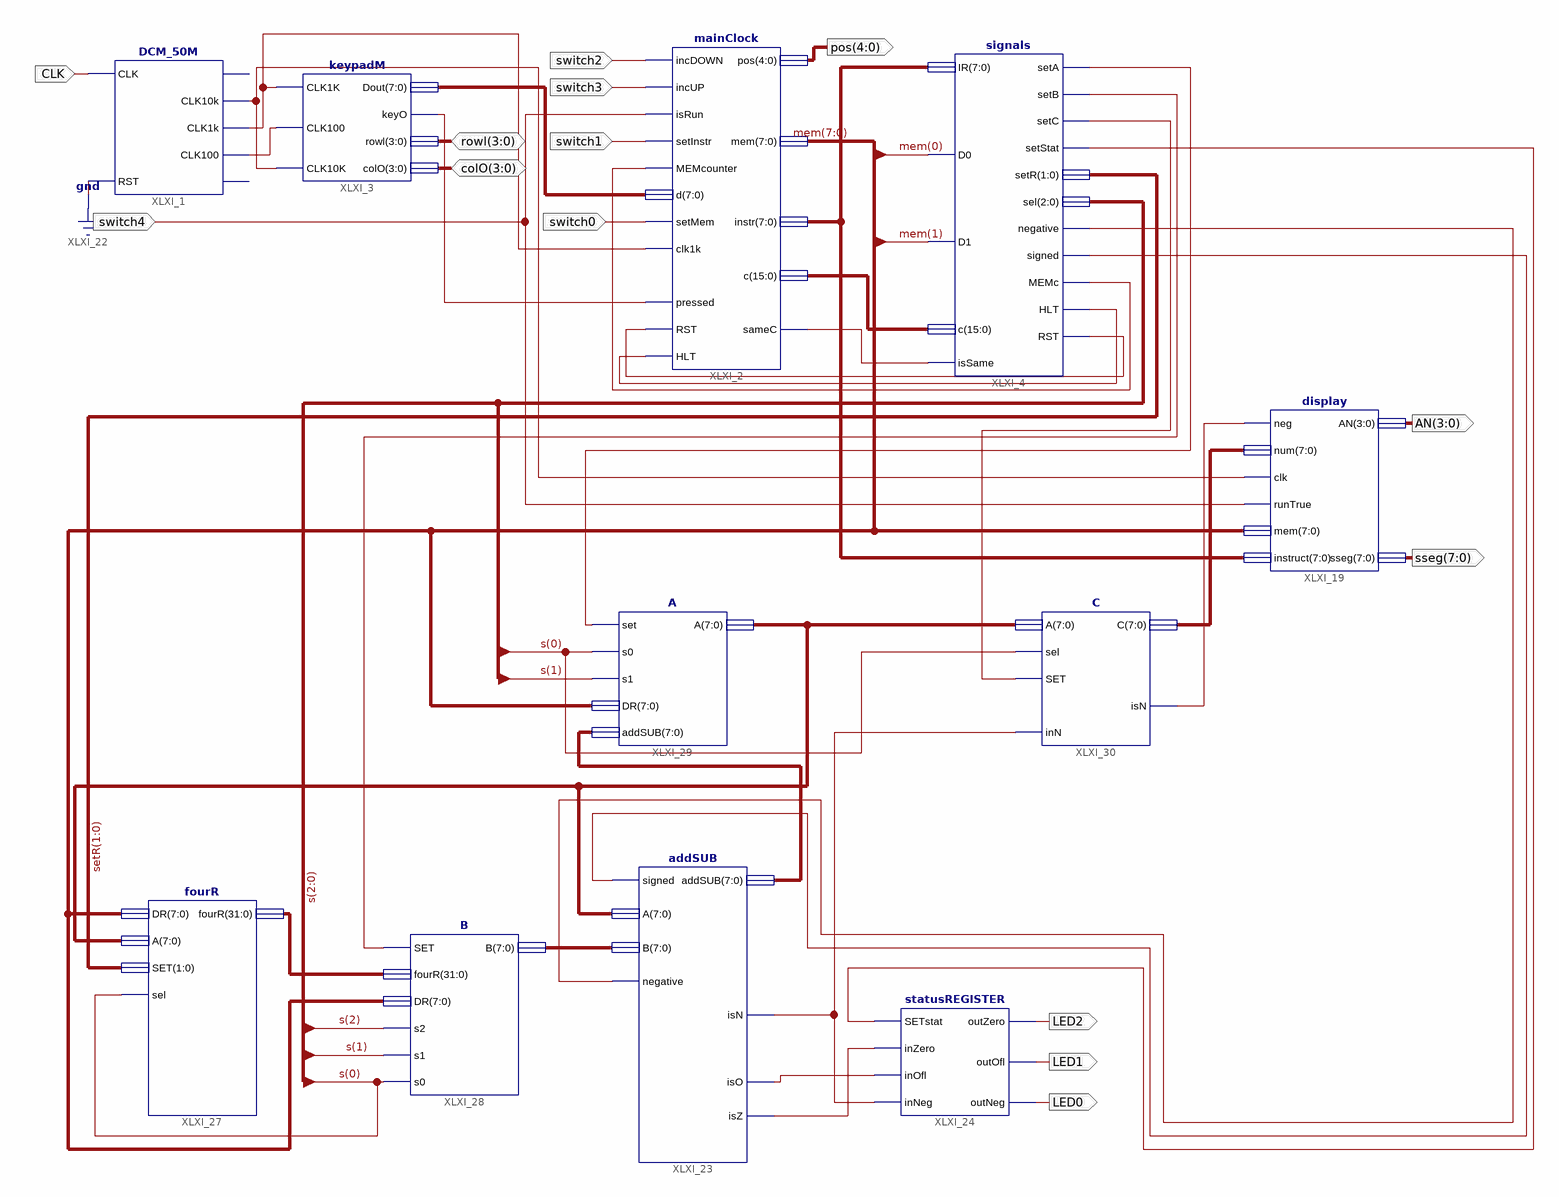
[diagram p0: schematic sheet 1]
// Xilinx ISE schematic computer.sch (spartan3e) as structural Verilog: 11 symbols, 14 ports
module computer (
  input  switch2,
  input  switch3,
  input  switch4,
  input  switch1,
  input  switch0,
  input  CLK,
  inout  [3:0] rowl,
  inout  [3:0] colO,
  output [4:0] pos,
  output LED2,
  output LED1,
  output LED0,
  output [3:0] AN,
  output [7:0] sseg
);

  wire XLXN_3, XLXN_10, XLXN_11, XLXN_34, XLXN_36, XLXN_96, XLXN_102, XLXN_123, XLXN_130, XLXN_131, XLXN_132,
       XLXN_142, XLXN_157, XLXN_158, XLXN_165, XLXN_194, XLXN_195, XLXN_196;
  wire [1:0] setR;
  wire [2:0] s;
  wire [7:0] mem, XLXN_33, XLXN_108, XLXN_160, XLXN_164, XLXN_166, XLXN_167;
  wire [15:0] XLXN_2;
  wire [31:0] XLXN_159;

  DCM_50M XLXI_1 (.CLK(CLK), .RST(1'b0), .CLK10k(XLXN_123), .CLK1k(XLXN_96), .CLK100(XLXN_36));  // open: CLK1M, CLK1
  keypadM XLXI_3 (
    .CLK1K(XLXN_96), .CLK100(XLXN_36), .CLK10K(XLXN_123), .rowl(rowl), .colO(colO), .Dout(XLXN_33),
    .keyO(XLXN_34));
  mainClock XLXI_2 (
    .clk1k(XLXN_96), .incDOWN(switch2), .incUP(switch3), .isRun(switch4), .setInstr(switch1),
    .MEMcounter(XLXN_102), .d(XLXN_33), .setMem(switch0), .pressed(XLXN_34), .c(XLXN_2), .pos(pos),
    .mem(mem), .instr(XLXN_108), .RST(XLXN_11), .HLT(XLXN_10), .sameC(XLXN_3));
  signals XLXI_4 (
    .IR(XLXN_108), .D0(mem[0]), .D1(mem[1]), .isSame(XLXN_3), .c(XLXN_2), .RST(XLXN_11), .HLT(XLXN_10),
    .negative(XLXN_158), .\signed (XLXN_157), .setC(XLXN_194), .setB(XLXN_195), .setStat(XLXN_142),
    .setA(XLXN_196), .sel(s), .setR(setR), .MEMc(XLXN_102));
  addSUB XLXI_23 (
    .A(XLXN_166), .B(XLXN_160), .negative(XLXN_158), .\signed (XLXN_157), .isO(XLXN_132), .addSUB(XLXN_167),
    .isZ(XLXN_131), .isN(XLXN_130));
  statusREGISTER XLXI_24 (
    .SETstat(XLXN_142), .inZero(XLXN_131), .inOfl(XLXN_132), .inNeg(XLXN_130), .outZero(LED2), .outOfl(LED1),
    .outNeg(LED0));
  display XLXI_19 (
    .neg(XLXN_165), .num(XLXN_164), .clk(XLXN_123), .runTrue(switch4), .mem(mem), .instruct(XLXN_108),
    .AN(AN), .sseg(sseg));
  fourR XLXI_27 (.DR(mem), .A(XLXN_166), .SET(setR), .sel(s[0]), .fourR(XLXN_159));
  B XLXI_28 (.SET(XLXN_195), .fourR(XLXN_159), .DR(mem), .s2(s[2]), .s1(s[1]), .s0(s[0]), .B(XLXN_160));
  A XLXI_29 (.set(XLXN_196), .s0(s[0]), .s1(s[1]), .DR(mem), .addSUB(XLXN_167), .A(XLXN_166));
  C XLXI_30 (.A(XLXN_166), .sel(s[0]), .SET(XLXN_194), .C(XLXN_164), .isN(XLXN_165), .inN(XLXN_130));
endmodule
